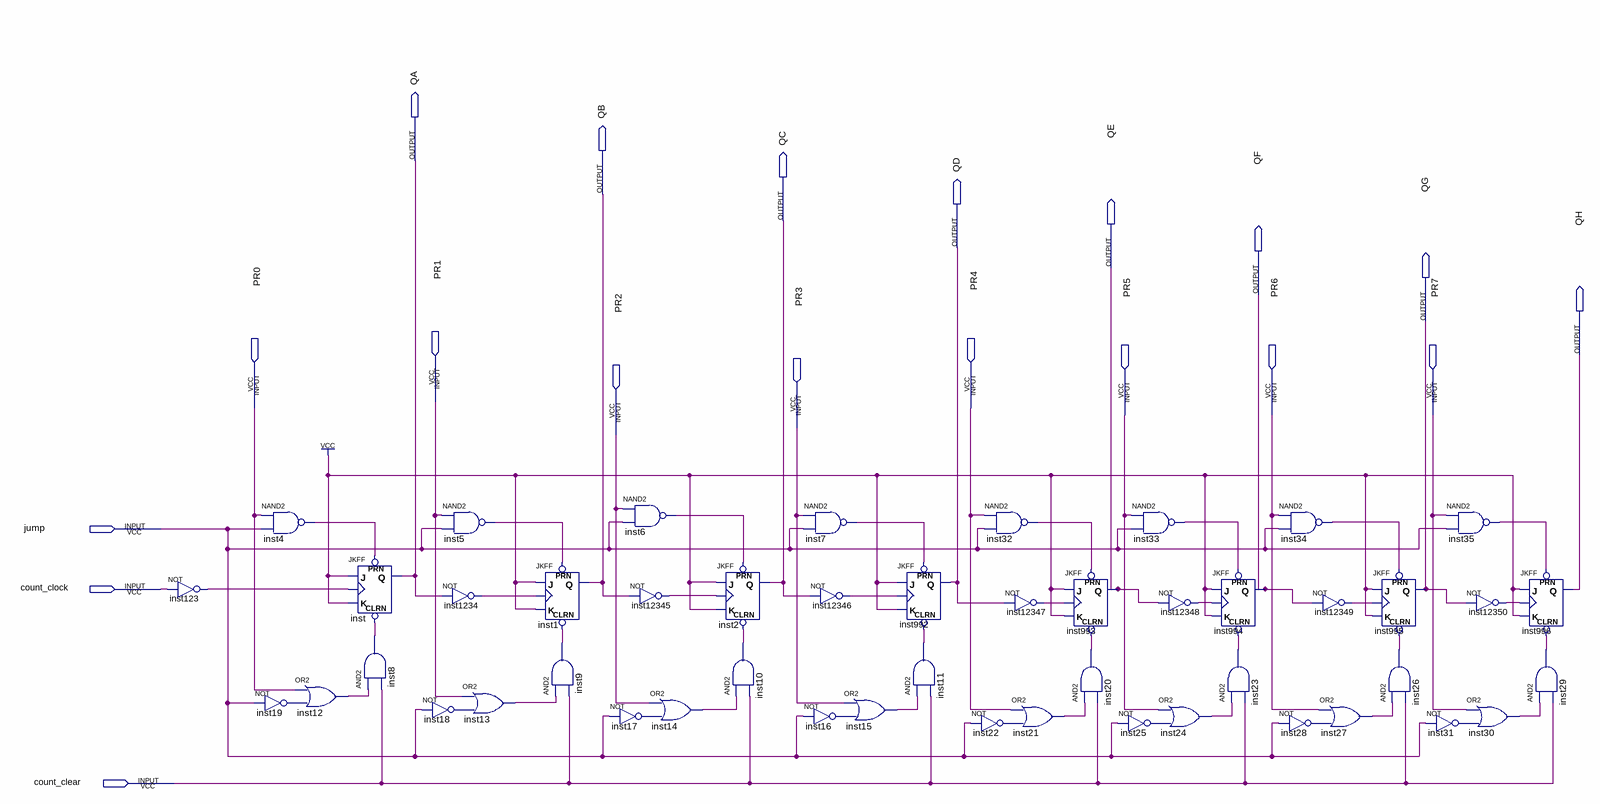
[diagram p0: schematic sheet]
// Quartus schematic assincrono.bdf as structural Verilog: 48 symbols, 19 pins
module assincrono (
  input  PR1,
  input  PR0,
  input  PR4,
  input  PR5,
  input  PR6,
  input  PR7,
  input  PR3,
  input  PR2,
  input  jump,
  input  count_clock,
  input  count_clear,
  output QA,
  output QB,
  output QC,
  output QD,
  output QE,
  output QF,
  output QG,
  output QH
);

  wire inst4_out, inst5_out, inst6_out, inst7_out, inst8_out, inst9_out, inst10_out, inst11_out, inst12_out,
       inst13_out, inst14_out, inst15_out, inst16_out, inst17_out, inst18_out, inst19_out, inst20_out,
       inst21_out, inst22_out, inst23_out, inst24_out, inst25_out, inst26_out, inst27_out, inst28_out,
       inst29_out, inst30_out, inst31_out, inst32_out, inst33_out, inst34_out, inst35_out, inst123_out,
       inst1234_out, inst12345_out, inst12346_out, inst12347_out, inst12348_out, inst12349_out, inst12350_out;

  not inst123 (inst123_out, count_clock);
  nand inst4 (inst4_out, PR0, jump);
  not inst19 (inst19_out, jump);
  or inst12 (inst12_out, PR0, inst19_out);
  JKFF inst (.PRN(inst4_out), .CLRN(inst8_out), .K(1'b1), .J(1'b1), .CLK(inst123_out), .Q(QA));
  and inst8 (inst8_out, inst12_out, count_clear);
  not inst18 (inst18_out, jump);
  nand inst5 (inst5_out, PR1, jump);
  not inst1234 (inst1234_out, QA);
  or inst13 (inst13_out, PR1, inst18_out);
  JKFF inst1 (.PRN(inst5_out), .CLRN(inst9_out), .K(1'b1), .J(1'b1), .CLK(inst1234_out), .Q(QB));
  and inst9 (inst9_out, inst13_out, count_clear);
  nand inst6 (inst6_out, PR2, jump);
  not inst12345 (inst12345_out, QB);
  or inst14 (inst14_out, PR2, inst17_out);
  not inst17 (inst17_out, jump);
  JKFF inst2 (.PRN(inst6_out), .CLRN(inst10_out), .K(1'b1), .J(1'b1), .CLK(inst12345_out), .Q(QC));
  and inst10 (inst10_out, inst14_out, count_clear);
  nand inst7 (inst7_out, PR3, jump);
  not inst12346 (inst12346_out, QC);
  not inst16 (inst16_out, jump);
  or inst15 (inst15_out, PR3, inst16_out);
  JKFF inst992 (.PRN(inst7_out), .CLRN(inst11_out), .K(1'b1), .J(1'b1), .CLK(inst12346_out), .Q(QD));
  and inst11 (inst11_out, inst15_out, count_clear);
  not inst22 (inst22_out, jump);
  nand inst32 (inst32_out, PR4, jump);
  not inst12347 (inst12347_out, QD);
  or inst21 (inst21_out, PR4, inst22_out);
  JKFF inst993 (.PRN(inst32_out), .CLRN(inst20_out), .K(1'b1), .J(1'b1), .CLK(inst12347_out), .Q(QE));
  and inst20 (inst20_out, inst21_out, count_clear);
  nand inst33 (inst33_out, PR5, jump);
  not inst25 (inst25_out, jump);
  not inst12348 (inst12348_out, QE);
  or inst24 (inst24_out, PR5, inst25_out);
  JKFF inst994 (.PRN(inst33_out), .CLRN(inst23_out), .K(1'b1), .J(1'b1), .CLK(inst12348_out), .Q(QF));
  and inst23 (inst23_out, inst24_out, count_clear);
  nand inst34 (inst34_out, PR6, jump);
  not inst28 (inst28_out, jump);
  not inst12349 (inst12349_out, QF);
  or inst27 (inst27_out, PR6, inst28_out);
  JKFF inst995 (.PRN(inst34_out), .CLRN(inst26_out), .K(1'b1), .J(1'b1), .CLK(inst12349_out), .Q(QG));
  and inst26 (inst26_out, inst27_out, count_clear);
  nand inst35 (inst35_out, PR7, jump);
  not inst31 (inst31_out, jump);
  not inst12350 (inst12350_out, QG);
  or inst30 (inst30_out, PR7, inst31_out);
  JKFF inst996 (.PRN(inst35_out), .CLRN(inst29_out), .K(1'b1), .J(1'b1), .CLK(inst12350_out), .Q(QH));
  and inst29 (inst29_out, inst30_out, count_clear);
endmodule
